# Altium schematic sheet BNO055.SchDoc
size 297 x 209 mm; SheetNumber: 5; SheetTotal: 11
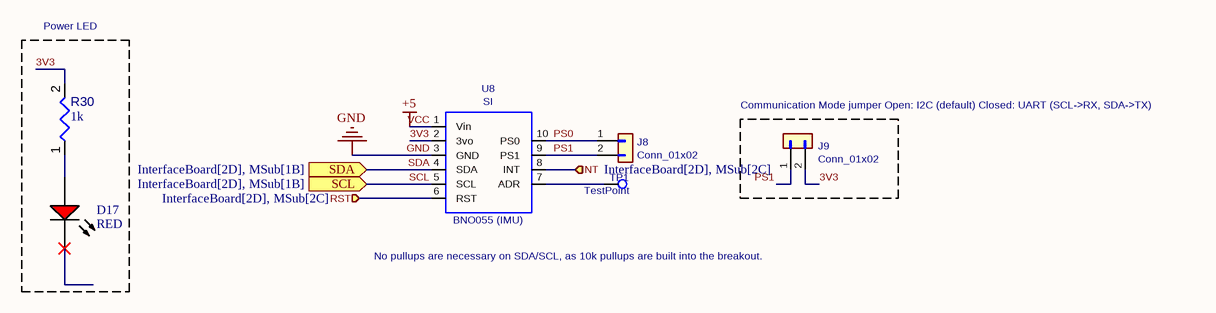
[diagram p0: BNO055.SchDoc]

## Parts
D17  RED  [LTST-C191KRKT_V]
J8  Conn_01x02  [HDR1X2]
J9  Conn_01x02  [HDR1X2]
R30  value 1k  [RESC1608X55X25ML10T15]  (hidden comment: Resistor 1k +/-1% 0603 100 mW)
TP1  TestPoint  [Test Point]
U8  SI  [BNO055 Adafruit Breakout]

## Blocks framed on the sheet
Power LED: D17 R30

## Ports
INT (in, see InterfaceBoard[2D], MSub[2C]), RST (in, see InterfaceBoard[2D], MSub[2C]), SCL (in, see InterfaceBoard[2D], MSub[1B]), SDA (in, see InterfaceBoard[2D], MSub[1B])

## Nets
GND: U8.3(GND)
VCC: U8.1(Vin)  [also labelled +5]
3V3: J9.2(Pin_2) R30.2 U8.2(3vo)
INT: U8.8(INT) ; port INT
PS0: J8.1(Pin_1) U8.10(PS0)
PS1: J8.2(Pin_2) J9.1(Pin_1) U8.9(PS1)
RST: U8.6(RST) ; port RST
SCL: U8.5(SCL) ; port SCL
SDA: U8.4(SDA) ; port SDA
NetD17_1: D17.1(A) R30.1
NetTP1_1: TP1.1 U8.7(ADR)

Not connected (* = marked no-connect by the designer): D17 2(K)*

## Notes on the sheet
- (near J9) Communication Mode jumper
  Open: I2C (default)
  Closed: UART (SCL->RX, SDA->TX)
- No pullups are necessary on SDA/SCL,
  as 10k pullups are built into the breakout.
- 1
- 2
- 3
- 4
- 5
- 6
- A
- B
- C
- D
- Title:
- File: BNO055.kicad_sch
- Sheet: /
- KiCad E.D.A.  kicad (5.1.4)-1
- Size: A4
- Date:
- Rev:
- Id: 1/1
- (in symbol SI) BNO055 (IMU)

## Library data of the parts
D17 = CMP-007-00024-2: LED Uni-Color Red, 62.5 mW, 25 mA, -30 to 85 degC, 2-Pin SMD, RoHS, Tape and Reel; Manufacturer: Lite-On; Power: 75mW; Forward Voltage: 2V; Luminous Intensity: 54mcd; Lens Style: Diffused; Viewing Angle: 130degrees; Forward Current: 20mA; Manufacturer URL: http://www.us.liteon.com/; Case/Package: 0603; Datasheet Version: Rev. F, 05/2013; Package Reference: C191KRKT; Datasheet URL: http://optoelectronics.liteon.com/upload/download/DS-22-99-0151/S_110_LTST-C190KRKT.pdf; Package Description: 2-Pin Surface Mount Device, Body 1.6 x 0.8 mm; Nominal Vf: 2V; Packaging: TapeandReel; RoHS Compliant: True; Pins: 2; Illumination Colour: Red; Colour: Red; Mounting Technology: SM; Package Quantity: 3000; Min Operating Temperature: -55°C; Max Operating Temperature: 85°C
R30 = CMP-009-00014-5: Chip Resistor, 1 KOhm, +/-1%, 0.1 W, -55 to 155 degC, 0603 (1608 Metric); Voltage Rating: 50V; Power: 100mW; Tolerance: 1%; Mounting Technology: SM; Pins: 2; Case/Package: 0603; Min Operating Temperature: -55°C; RoHS Compliant: True; Max Operating Temperature: 155°C
J8 J9 = Conn_01x02: Value: Conn_01x02; Footprint: Connector_PinHeader_2.54mm:PinHeader_1x02_P2.54mm_Vertical
TP1 = TestPoint: Value: TestPoint; Footprint: TestPoint:TestPoint_Plated_Hole_D2.0mm
U8 = SI: Value: SI; Footprint: Sprite:SI